# EAGLE design extracticon v2 (EAGLE 5.12)
DATABASE: ../../partsdb.txt; PARTNO: *
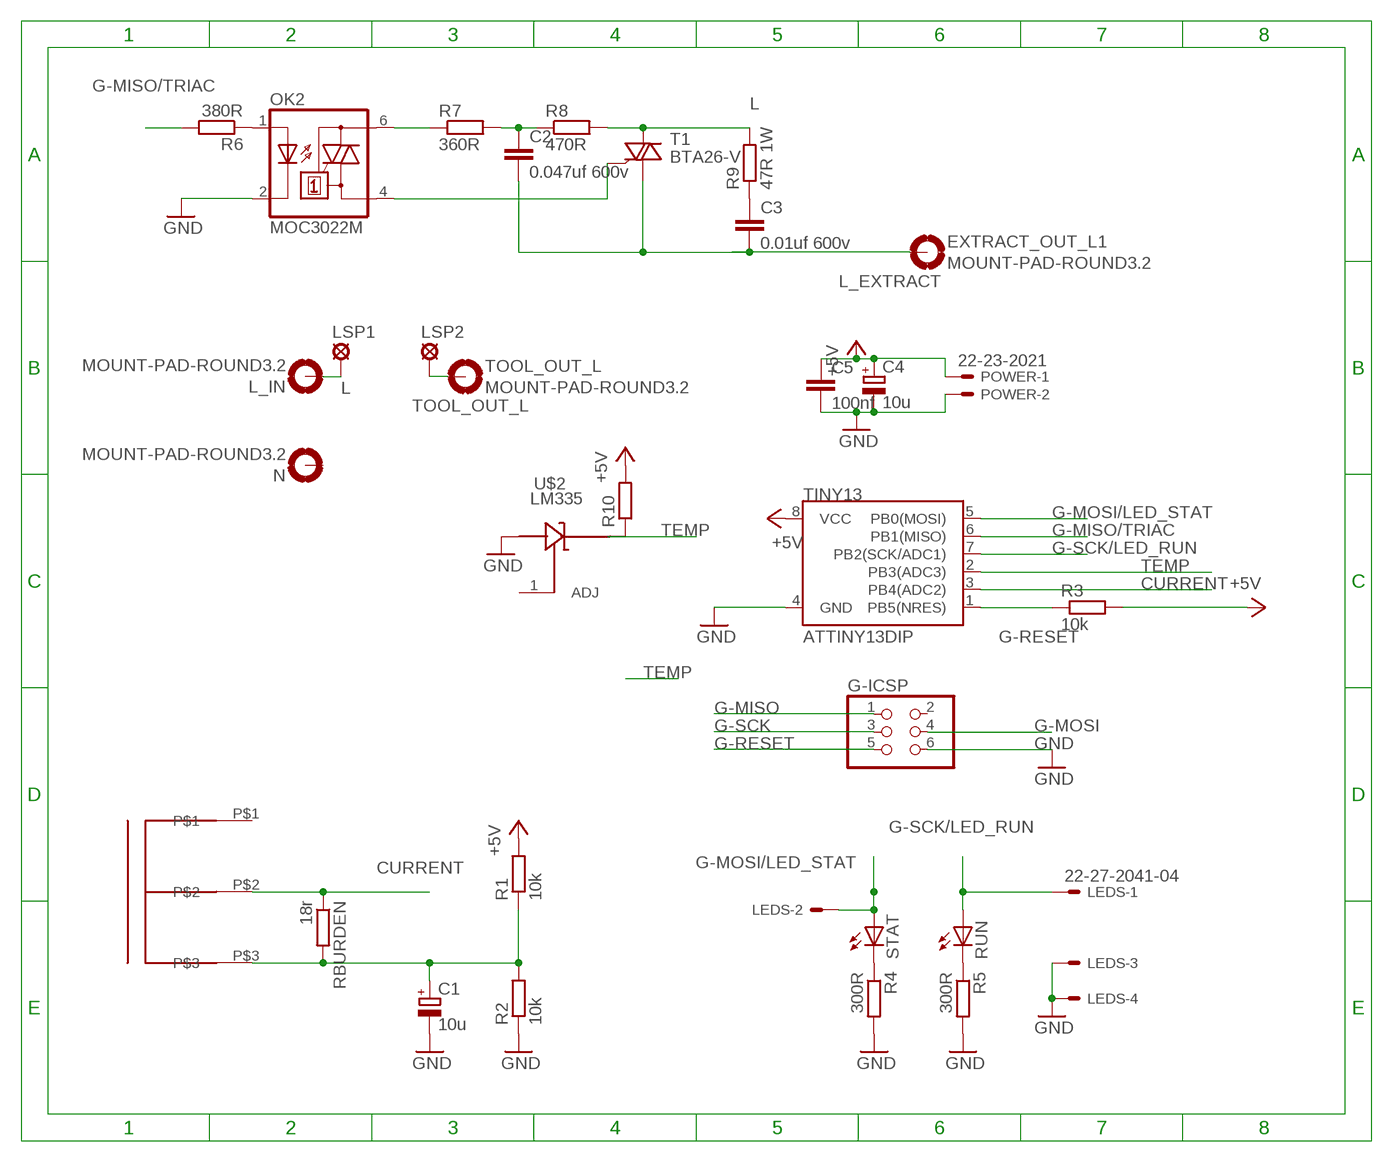
[diagram p0: schematic, sheet 1]

## Parts
C1  10u  CPOL-EUE2.5-5  [E2,5-5]
C2  0.047uf 600v  C-EU075-052X106  [C075-052X106]
C3  0.01uf 600v  C-EU050-050X075  [C050-050X075]
C4  10u  CPOL-EUE2.5-5  [E2,5-5]
C5  100nf  C-EU050-025X075  [C050-025X075]
CT  CT  [CT]
EXTRACT_OUT_L1  MOUNT-PAD-ROUND3.2  [3,2-PAD]
G-ICSP  PINHD-2X3  [2X03]
L_IN  MOUNT-PAD-ROUND3.2  [3,2-PAD]
LEDS  22-27-2041-04  [6410-04]
LSP1  SE14  [SE14]
LSP2  SE14  [SE14]
N  MOUNT-PAD-ROUND3.2  [3,2-PAD]
OK2  MOC3022M  [DIL06]
POWER  22-23-2021  [22-23-2021]
R1  10k  R-EU_0204/7  [0204/7]
R2  10k  R-EU_0204/7  [0204/7]
R3  10k  R-EU_0204/7  [0204/7]
R4  300R  R-EU_0204/7  [0204/7]
R5  300R  R-EU_0204/7  [0204/7]
R6  380R  R-EU_0204/7  [0204/7]
R7  360R  R-EU_0204/7  [0204/7]
R8  470R  R-EU_0204/7  [0204/7]
R9  47R 1W  R-EU_0411/12  [0411/12]
R10  R-EU_0204/7  [0204/7]
RBURDEN  18r  R-EU_0204/7  [0204/7]
RUN  LED5MM  [LED5MM]
STAT  LED5MM  [LED5MM]
T1  BTA26-V  [TOP3S-1]
TINY13  ATTINY13DIP  [DIP08]
TOOL_OUT_L  MOUNT-PAD-ROUND3.2  [3,2-PAD]
U$2  LM335  [TO92]

## Nets
+5V: C4.+ C5.1 POWER.1 R1.2 R3.2 R10.2 TINY13.8(VCC)
CURRENT: CT.P$2 RBURDEN.1 TINY13.3(PB4(ADC2))
G-MISO: G-ICSP.1
G-MISO/TRIAC: R6.2 TINY13.6(PB1(MISO))
G-MOSI: G-ICSP.4
G-MOSI/LED_STAT: LEDS.2 STAT.A TINY13.5(PB0(MOSI))
G-RESET: G-ICSP.5 R3.1 TINY13.1(PB5(NRES))
G-SCK: G-ICSP.3
G-SCK/LED_RUN: LEDS.1 RUN.A TINY13.7(PB2(SCK/ADC1))
GND: C1.- C4.- C5.2 G-ICSP.6 LEDS.3 LEDS.4 OK2.2(C) POWER.2 R2.1 R4.2 R5.2 TINY13.4(GND) U$2.3(OUT)
L [power]: L_IN.B3,2(MOUNT) LSP1.MP R8.2 R9.2 T1.A2
L_EXTRACT [power]: C2.2 C3.2 EXTRACT_OUT_L1.B3,2(MOUNT) T1.A1
N$1: OK2.6(A2) R7.1
N$2: C1.+ CT.P$3 R1.1 R2.2 RBURDEN.2
N$3: R10.1 U$2.2(IN)
N$8: C2.1 R7.2 R8.1
N$11: OK2.1(A) R6.1
N$12 [power]: C3.1 R9.1
N$13: R4.1 STAT.K(C)
N$14: R5.1 RUN.K(C)
TEMP: TINY13.2(PB3(ADC3))
TOOL_OUT_L: LSP2.MP TOOL_OUT_L.B3,2(MOUNT)
TRI_GATE: OK2.4(A1) T1.G
Unconnected: CT.P$1 G-ICSP.2 N.B3,2(MOUNT) U$2.1(ADJ)

## Library data of the parts
C1 C4 = rcl:CPOL-EU: POLARIZED CAPACITOR, European symbol
C2 C3 C5 = matt rcl:C-EU: CAPACITOR, European symbol
CT = matt:CT
EXTRACT_OUT_L1 L_IN N TOOL_OUT_L = holes:MOUNT-PAD-ROUND: MOUNTING PAD, round
G-ICSP = pinhead:PINHD-2X3: PIN HEADER
LEDS = con-molex:22-?-04: CONNECTOR wire to board 2.54 mm (.1 inch) pitch header; OC_FARNELL: unknown; OC_NEWARK: unknown
LSP1 LSP2 = solpad:SE14: SOLDER PAD E1553, drill 1,4mm, distributor Buerklin, 07F820
OK2 = optocoupler:MOC30*M: RANDOM-PHASE OPTOISOLATORS TRIAC DRIVER OUTPUT Source: http://www.fairchildsemi.com MOC3020-M.pdf; MF: FAIRCHILD SEMICONDUCTOR; MPN: MOC3022-M; OC_FARNELL: 1021086; OC_NEWARK: 58K1956
POWER = con-molex:22-23-2021: .100" (2.54mm) Center Header - 2 Pin; MF: MOLEX; MPN: 22-23-2021; OC_FARNELL: 1462926; OC_NEWARK: 25C3832
R1-R10 RBURDEN = matt rcl:R-EU_: RESISTOR, European symbol
RUN STAT = matt led:LED: LED OSRAM: - CHIPLED LG R971, LG N971, LY N971, LG Q971, LY Q971, LO R971, LY R971 LH N974, LH R974 LS Q976, LO Q976, LY Q976 LO Q996 - Hyper CHIPLED LW Q18S LB Q993, LB Q99A, LB R99A - SideLED LS A670, LO A670, LY A670, LG A670, LP A670 LB A673, LV A673, LT A673, LW A673 LH A674 LY A675 LS A676, LA A676, LO A676, LY A676, LW A676 LS A679, LY A679, LG A679 - Hyper Micro SIDELED® LS Y876, LA Y876, LO Y876, LY Y876 LT Y87S - SmartLED LW L88C, LW L88S LB L89C, LB L89S, LG L890 LS L89K, LO L89K, LY L89K LS L896, LA L896, LO L896, LY L896 - TOPLED LS T670, LO T670, LY T670, LG T670, LP T670 LSG T670, LSP T670, LSY T670, LOP T670, LYG T670 LG T671, LOG T671, LSG T671 LB T673, LV T673, LT T673, LW T673 LH T674 LS T676, LA T676, LO T676, LY T676, LB T676, LH T676, LSB T676, LW T676 LB T67C, LV T67C, LT T67C, LS T67K, LO T67K, LY T67K, LW E67C LS E67B, LA E67B, LO E67B, LY E67B, LB E67C, LV E67C, LT E67C LW T67C LS T679, LY T679, LG T679 LS T770, LO T770, LY T770, LG T770, LP T770 LB T773, LV T773, LT T773, LW T773 LH T774 LS E675, LA E675, LY E675, LS T675 LS T776, LA T776, LO T776, LY T776, LB T776 LHGB T686 LT T68C, LB T68C - Hyper Mini TOPLED® LB M676 - Mini TOPLED Santana® LG M470 LS M47K, LO M47K, LY M47K Source: http://www.osram.convergy.de LUXEON: - LUMILED® LXK2-PW12-R00, LXK2-PW12-S00, LXK2-PW14-U00, LXK2-PW14-V00 LXK2-PM12-R00, LXK2-PM12-S00, LXK2-PM14-U00 LXK2-PE12-Q00, LXK2-PE12-R00, LXK2-PE12-S00, LXK2-PE14-T00, LXK2-PE14-U00 LXK2-PB12-K00, LXK2-PB12-L00, LXK2-PB12-M00, LXK2-PB14-N00, LXK2-PB14-P00, LXK2-PB14-Q00 LXK2-PR12-L00, LXK2-PR12-M00, LXK2-PR14-Q00, LXK2-PR14-R00 LXK2-PD12-Q00, LXK2-PD12-R00, LXK2-PD12-S00 LXK2-PH12-R00, LXK2-PH12-S00 LXK2-PL12-P00, LXK2-PL12-Q00, LXK2-PL12-R00 Source: www.luxeon.com KINGBRIGHT: KA-3528ASYC Source: www.kingbright.com
T1 = triac:BTA26: 25A TRIAC Source: http://www.st.com/stonline/products/literature/ds/7470.pdf
TINY13 = SparkFun:ATTINY13
U$2 = matt:LM335

## Net classes
0 default: width 0.5 mm
1 power: width 2.54 mm, clearance 2 mm

## Board
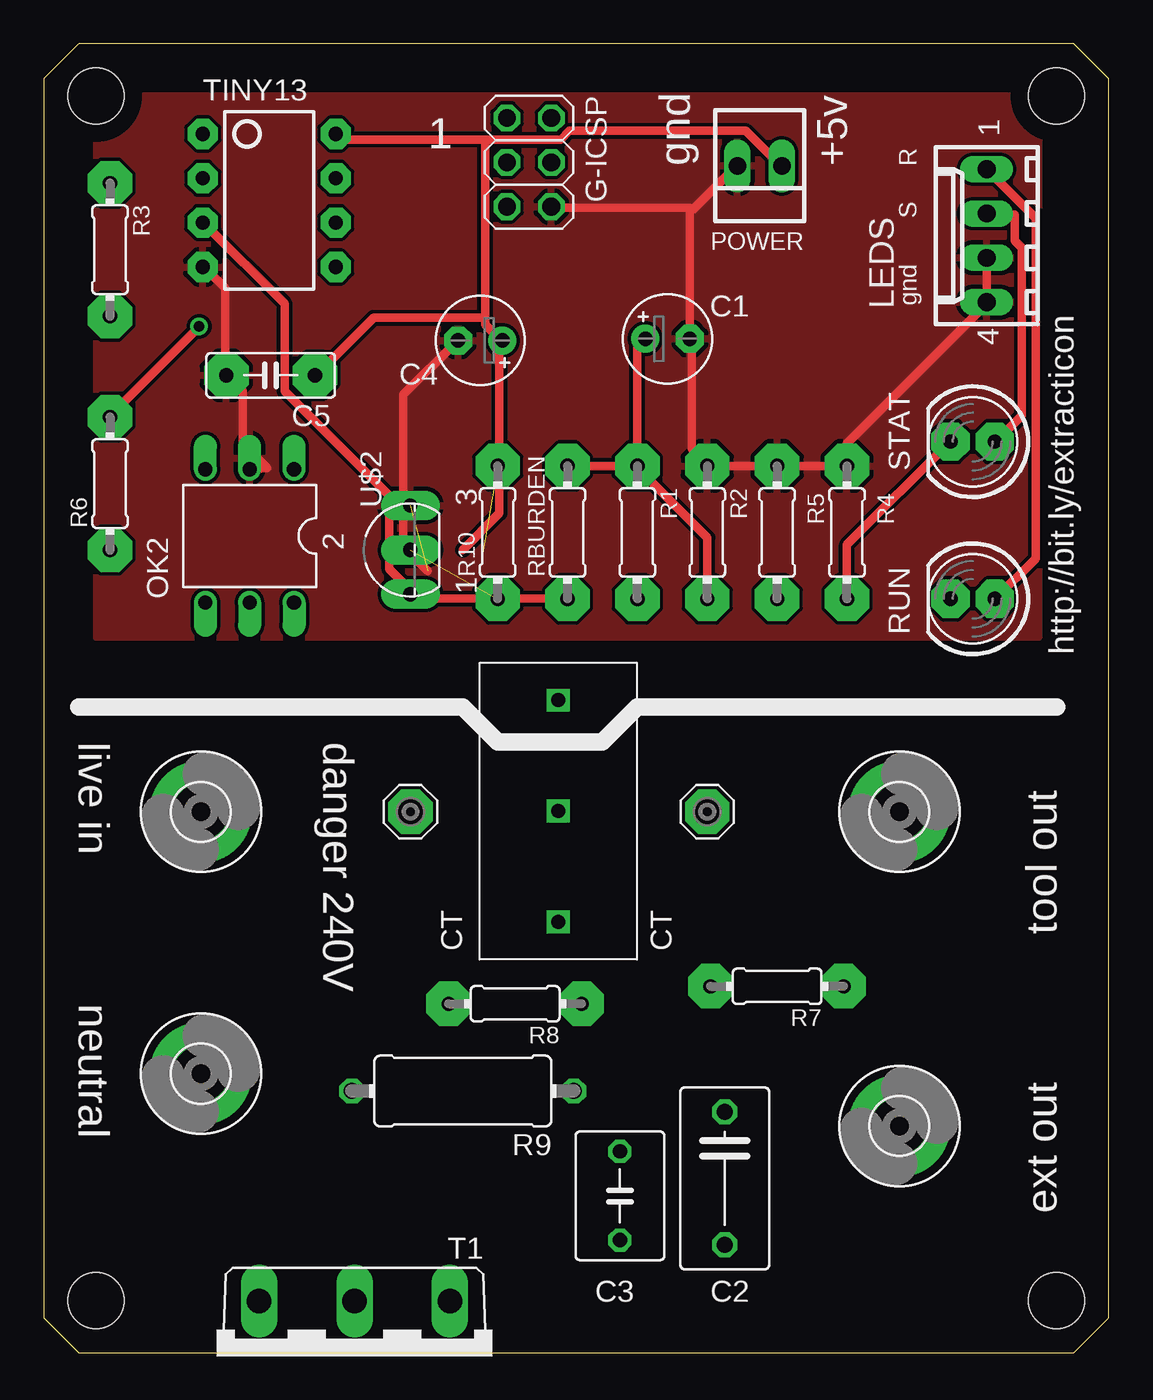
[diagram p1: board, top side]
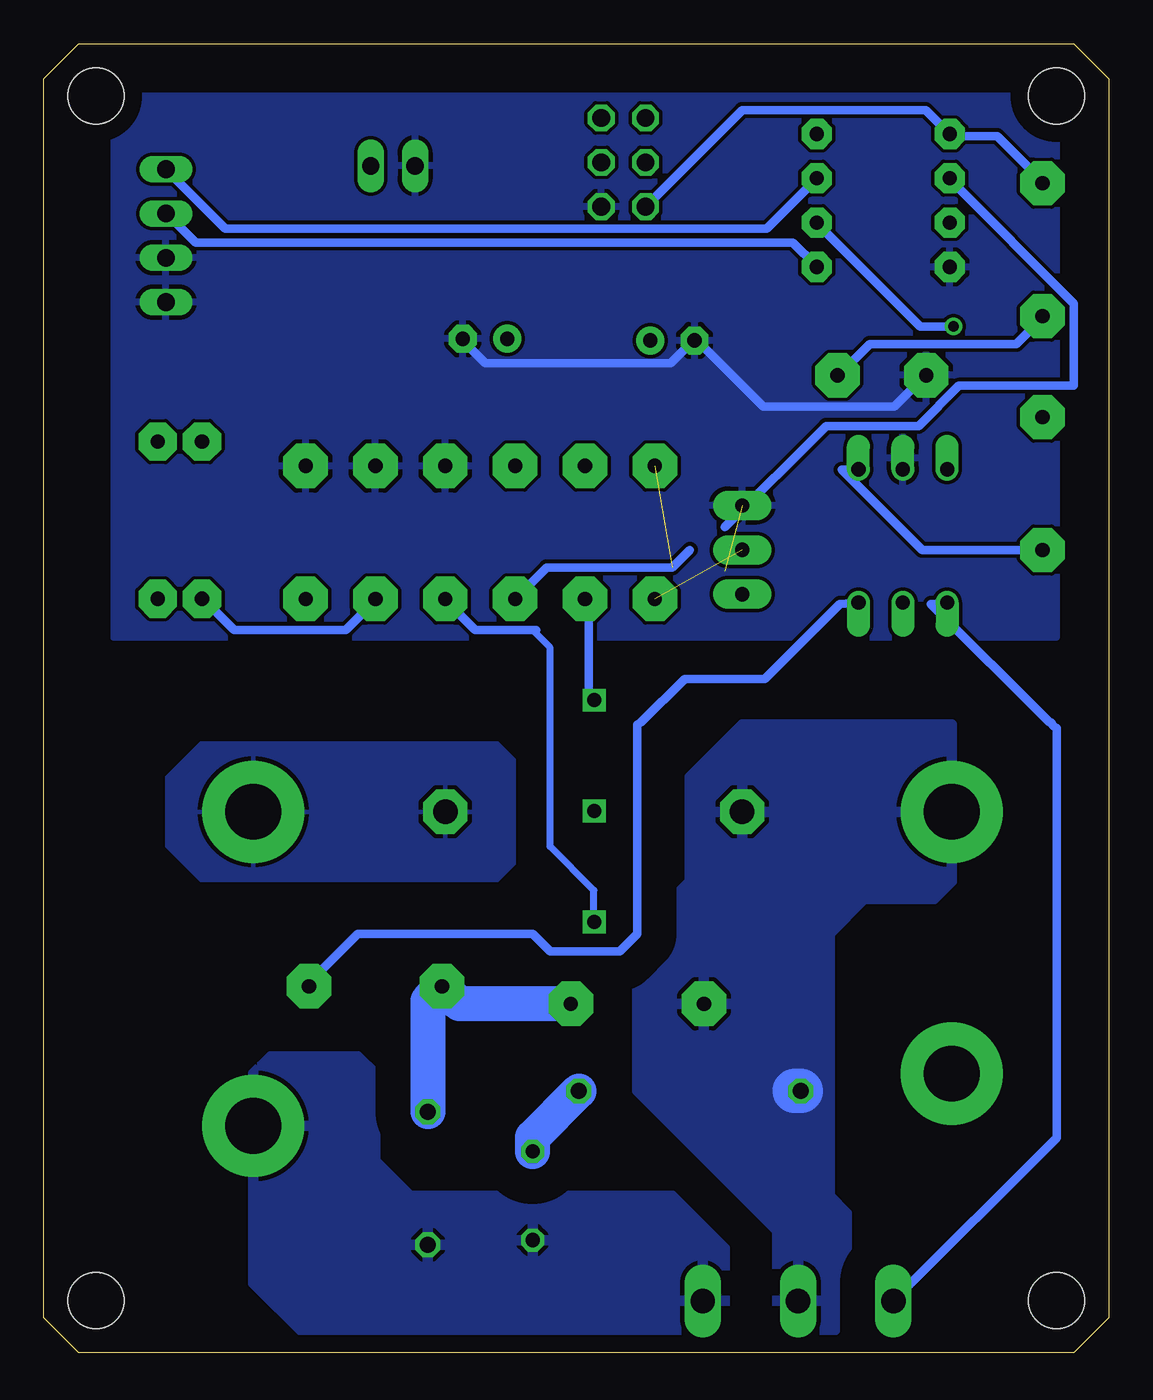
[diagram p2: board, bottom side, seen from below]

Size 61 x 75 mm. Coordinates in mm from the lower left corner, seen from the top.
Outline: 61,73 59,75 2,75 0,73 0,2 2,0 59,0 61,2 61,73
Copper layers (1*16): Top 0.035mm / dielectric 1.5mm / Bottom 0.035mm
Design rules "default": minimum track width 10mil, minimum drill 24mil, track to track 8mil, track to pad 8mil, pad to pad 8mil, via to via 8mil, smd to smd 8mil, copper to edge 40mil, drill to drill 8mil, minimum pad ring 10mil, minimum via ring 8mil, stop-mask expansion 4mil, vias tented up to drill 0mil, thermal gap 10mil
Holes 3.2 mm at 3,3 58,3 3,72 58,72

### Footprints (pad centres in the part's own frame; a part is rotated, then mirrored left to right if it is on the bottom)
E2,5-5 = drill 0.813 pad 1.6 round: + -1.27,0 | drill 0.813 pad 1.6 octagon: - 1.27,0
C075-052X106 = drill 0.914 octagon: 1 -3.81,0; 2 3.81,0
C050-050X075 = drill 0.813 octagon: 1 -2.54,0; 2 2.54,0
C050-025X075 = drill 0.813 pad 2.54 octagon: 1 -2.54,0; 2 2.54,0
CT = drill 0.8 square: P$1 0,0; P$2 6.35,0; P$3 -6.35,0
3,2-PAD = drill 3.2 pad 5.842 round: B3,2 0,0
2X03 = drill 1.016 octagon: 1 -2.54,-1.27; 2 -2.54,1.27; 3 0,-1.27; 4 0,1.27; 5 2.54,-1.27; 6 2.54,1.27
6410-04 = drill 1.016 long: 1 3.81,0; 2 1.27,0; 3 -1.27,0; 4 -3.81,0
SE14 = drill 1.397 pad 2.54 octagon: MP 0,0
DIL06 = drill 0.813 offset: 1 -2.54,-3.81; 2 0,-3.81; 3 2.54,-3.81; 4 2.54,3.81; 5 0,3.81; 6 -2.54,3.81
22-23-2021 = drill 1 long: 1 -1.27,0; 2 1.27,0
0204/7 = drill 0.813 pad 2.54 octagon: 1 -3.81,0; 2 3.81,0
0411/12 = drill 0.914 octagon: 1 -6.35,0; 2 6.35,0
LED5MM = drill 0.813 pad 2.184 octagon: A -1.27,0; K 1.27,0
TOP3S-1 = drill 1.397 long: A1 -5.461,-3.175; A2 0,-3.175; G 5.461,-3.175
DIP08 = drill 0.813 pad 1.727 octagon: 1 -3.81,-3.81; 2 -1.27,-3.81; 3 1.27,-3.81; 4 3.81,-3.81; 5 3.81,3.81; 6 1.27,3.81; 7 -1.27,3.81; 8 -3.81,3.81
TO92 = drill 0.813 pad 1.676 long: 1 -2.54,0; 2 0,0; 3 2.54,0

### Placement (x,y rotation side)
C1  35.73,58.09 0 top
C2  39,10 270 top
C3  33,9 270 top
C4  25,58 180 top
C5  13,56 180 top
CT  29.47,31.04 90 top
EXTRACT_OUT_L1  49,13 0 top
G-ICSP  27.8,68.2 270 top
L_IN  9,31 0 top
LEDS  54,64 90 top
LSP1  21,31 0 top
LSP2  38,31 0 top
N  9,16 0 top
OK2  11.8,46.8 180 top
POWER  41,68 180 top
R1  34,47 270 top
R2  38,47 270 top
R3  3.8,63.2 270 top
R4  46,47 90 top
R5  42,47 90 top
R6  3.8,49.8 90 top
R7  42,21 180 top
R8  27,20 180 top
R9  24,15 180 top
R10  26,47 90 top
RBURDEN  30,47 90 top
RUN  53.2,43.2 180 top
STAT  53.2,52.2 180 top
T1  17.8,-0.2 180 top
TINY13  12.92,66.02 270 top
TOOL_OUT_L  49,31 0 top
U$2  21,46 90 top

### Tracks (layer width: path | path; a pad name or v marks a point on that pad's centre or on a via)
+5V  (2 unrouted)
  Top 0.5: 25.3,69.5 16.8,69.5 16.8,69.8 TINY13.8 | 25.3,69.5 29.6,69.5 30.1,70 40.2,70 42.2,68 POWER.1 | 25.3,59.3 25.3,58.9 26.2,58 C4.+ 26.1,57.8 26.1,48.1 24,46 | 25.3,59.3 25.3,69.5 | C5.1 15.6,56 18.9,59.3 25.3,59.3
  Bottom 0.5: 24,46 25,45 32.2,45 R1.2 | R3.2 3.8,59.3 5.3,57.8 13.7,57.8 15.5,56 C5.1
CURRENT
  Top 0.5: TINY13.3 9.2,64.7 13.8,60.1 13.8,55.1 19.8,49.1 19.8,44.9 21.5,43.2 RBURDEN.1
  Bottom 0.5: CT.P$2 29.5,37.4 | CT.P$2 29.6,37.6 | CT.P$2 29.7,37.8 | CT.P$2 29.8,38 29.8,43.1 30,43.1 RBURDEN.1
G-MISO/TRIAC  (via drill 0.61)
  Top 0.5: v8.9,58.8 3.8,53.7 R6.2
  Bottom 0.5: v8.9,58.8 10.8,58.8 16.7,64.7 TINY13.6
G-MOSI/LED_STAT
  Top 0.5: LEDS.2 54,65.2 55.6,65.2 55.6,63.7 56,63.3 56,53.7 54.5,52.2 STAT.A
  Bottom 0.5: TINY13.5 16.8,62.3 18.1,63.6 52.3,63.6 53.9,65.2 54,65.2 LEDS.2
G-RESET
  Bottom 0.5: G-ICSP.5 26.5,65.7 21,71.2 10.5,71.2 9.2,69.9 TINY13.1 8.9,69.7 6.4,69.7 3.8,67.1 R3.1
G-SCK/LED_RUN
  Top 0.5: LEDS.1 56.8,65 56.8,45.5 54.5,43.2 RUN.A
  Bottom 0.5: TINY13.7 16.8,67.2 19.6,64.4 50.6,64.4 LEDS.1
GND  (1 unrouted)
  Top 0.5: LEDS.3 LEDS.4 53.9,60 46,52.1 R4.2 45.8,50.8 42.2,50.8 R5.2 R2.1 37.9,51 37.1,51.8 37.1,57.9 C1.- 37,65.3 37.15,65.45 | OK2.2 12.8,50.7 11.4,52.1 11.4,55.1 10.5,56 C5.2 10.4,56.2 10.4,61 9.2,62.2 TINY13.4 | 37.15,65.45 39.7,68 POWER.2 | G-ICSP.6 29.1,65.6 37,65.6 37.15,65.45 | 22,44.8 20.6,46.2 20.6,54.9 23.7,58 C4.-
  Bottom 0.5: C1.- 37,58 35.7,56.7 25.1,56.7 23.8,58 C4.- 23.5,57.9 19.8,54.2 12.3,54.2 10.5,56 C5.2
  pour Top (isolate 0.2): 3,41 57,41 57,72 3,72 3,42
  pour Bottom (isolate 0.2): 3,41 3,72 57,72 57,41
L
  Bottom 2.54: R9.2 18,15
  pour Bottom (isolate 0.813): 9,36 21,36 24,33 24,27 27,24 27,15 19,7 19,2 18,1 16,1 15,2 15,8 16,9 16,24 14,26 10,26 9,27
L_EXTRACT
  pour Bottom (isolate 0.813): 22,1 22,6 25,9 40,9 42,11 42,16 43,17 48,17 49,16 49,4 46,1
N$1
  Bottom 0.5: R7.1 45.81,21.19 43,24 33,24 32,23 28,23 27,24 27,36 26.8,36.1 24.3,38.6 19.7,38.6 15.4,42.9 OK2.6
N$2
  Top 0.5: C1.+ 34.4,58 34,57.6 R1.1 | RBURDEN.2 33.8,50.8 R1.1 | R1.1 34.1,50.6 38,46.7 R2.2
  Bottom 0.406: 29.5,24.7 29.5,26.5 32,29 32,40.4 33,41.4
  Bottom 0.5: CT.P$3 29.5,24.7 | 32.8,41.4 33,41.4 36.3,41.4 38,43.1 R2.2
N$3  (1 unrouted)
N$8
  Bottom 2: R8.1 37.19,20 R7.2 39,20.19 C2.1
N$11
  Bottom 0.5: OK2.1 15.3,50.6 10.7,46 R6.1
N$12
  Bottom 2: C3.1 33,12.35 R9.1
N$13
  Top 0.5: STAT.K 51.9,52.2 46,46.3 R4.1
N$14
  Bottom 0.5: RUN.K 51.9,43.2 50.1,41.4 43.7,41.4 42,43.1 R5.1
TEMP
  Bottom 0.5: 22,47.3 16.2,53.1 10.9,53.1 8.6,55.4 2,55.4 2,60.1 9.1,67.2 TINY13.2
TOOL_OUT_L
  pour Bottom (isolate 0.813): 35,35 52,35 54,33 54,29 52,27 35,27 34,28 34,34
TRI_GATE
  Bottom 0.5: T1.G 3,12.31 3,35.8 3.2,35.9 3.3,36.1 3.4,36.1 10.2,42.9 OK2.4

### Text on the board
tNames: 1 | gnd | +5v | R | S | gnd | http://bit.ly/extracticon | live in | danger 240V | tool out | neutral | ext out